# EAGLE design ecg_leaddetection_module_v2.0.1_jan2024 (EAGLE 9.6.2)
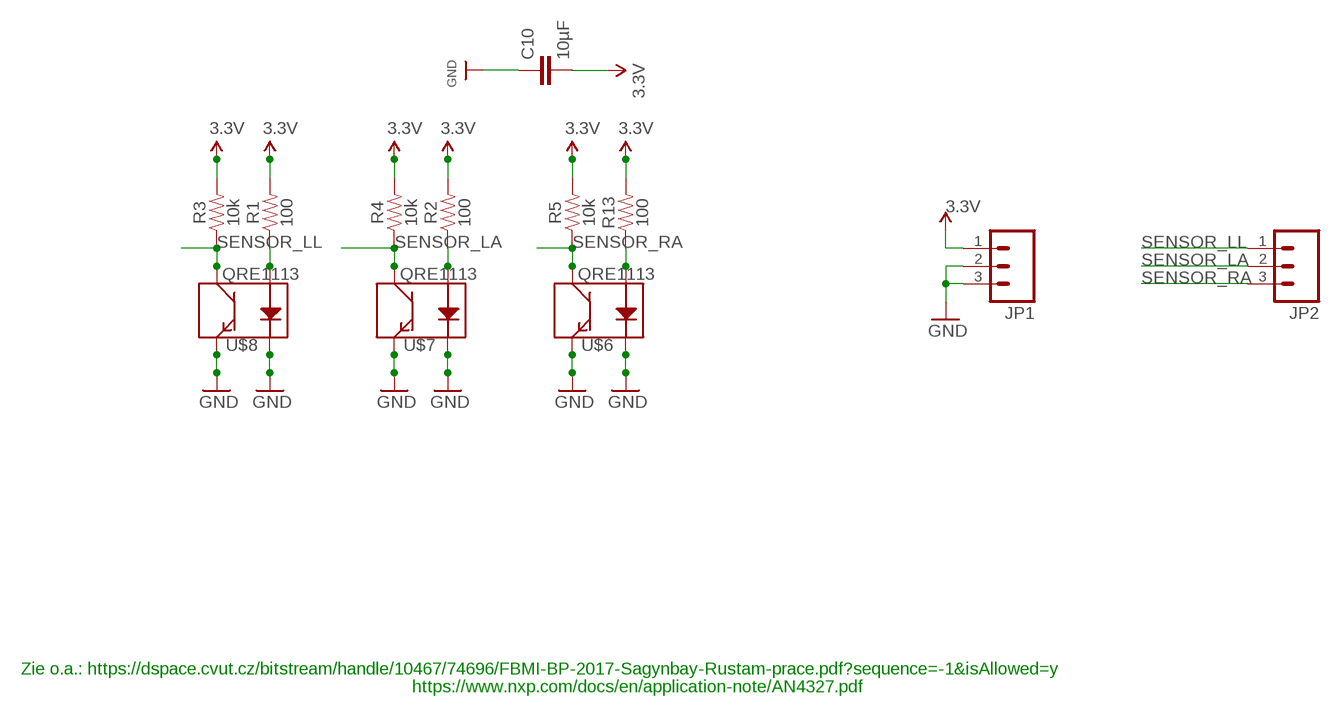
[diagram p0: schematic, sheet 1]

## Parts
C10  10µF  C-EUC0805  [C0805]
JP1  M03PTH  [1X03]
JP2  M03PTH  [1X03]
R1  100  100OHM-0603-1/4W-5%  [0603]
R2  100  100OHM-0603-1/4W-5%  [0603]
R3  10k  10KOHM-0603-1/10W-1%  [0603]
R4  10k  10KOHM-0603-1/10W-1%  [0603]
R5  10k  10KOHM-0603-1/10W-1%  [0603]
R13  100  100OHM-0603-1/4W-5%  [0603]
U$6  QRE1113  [QRE1113]
U$7  QRE1113  [QRE1113]
U$8  QRE1113  [QRE1113]

## Nets
3.3V: C10.2 JP1.1 R1.2 R2.2 R3.2 R4.2 R5.2 R13.2 ; supply symbol labelled VCC
GND: C10.1 JP1.2 JP1.3 U$6.2(K) U$6.4(E) U$7.2(K) U$7.4(E) U$8.2(K) U$8.4(E)
N$1: R1.1 U$8.1(A)
N$2: R2.1 U$7.1(A)
N$3: R13.1 U$6.1(A)
SENSOR_LA: JP2.2 R4.1 U$7.3(C)
SENSOR_LL: JP2.1 R3.1 U$8.3(C)
SENSOR_RA: JP2.3 R5.1 U$6.3(C)

## Notes on the sheet
- Zie o.a.: https://dspace.cvut.cz/bitstream/handle/10467/74696/FBMI-BP-2017-Sagynbay-Rustam-prace.pdf?sequence=-1&isAllowed=y
- https://www.nxp.com/docs/en/application-note/AN4327.pdf

## Library data of the parts
C10 = rcl:C-EU: CAPACITOR, European symbol; SPICEPREFIX: C
JP1 JP2 = SparkFun:M03: Header 3 Standard 3-pin 0.1" header. Use with straight break away headers (SKU : PRT-00116), right angle break away headers (PRT-00553), swiss pins (PRT-00743), machine pins (PRT-00117), and female headers (PRT-00115). Molex polarized connector foot print use with SKU : PRT-08232 with associated crimp pins and housings.
R1 R2 R13 = SparkFun-Resistors:100OHM: 100Ω resistor A resistor is a passive two-terminal electrical component that implements electrical resistance as a circuit element. Resistors act to reduce current flow, and, at the same time, act to lower voltage levels within circuits. - Wikipedia; PROD_ID: RES-12438
R3-R5 = SparkFun-Resistors:10KOHM: 10kΩ resistor A resistor is a passive two-terminal electrical component that implements electrical resistance as a circuit element. Resistors act to reduce current flow, and, at the same time, act to lower voltage levels within circuits. - Wikipedia; PROD_ID: RES-00824
U$6-U$8 = SparkFun:QRE1113

## Net classes
1 pwr: width 0.254 mm
2 ground: width 0.254 mm, drill 0.254 mm, clearance 0.152 mm
3 power: width 0.254 mm, drill 0.254 mm, clearance 0.152 mm

## Board
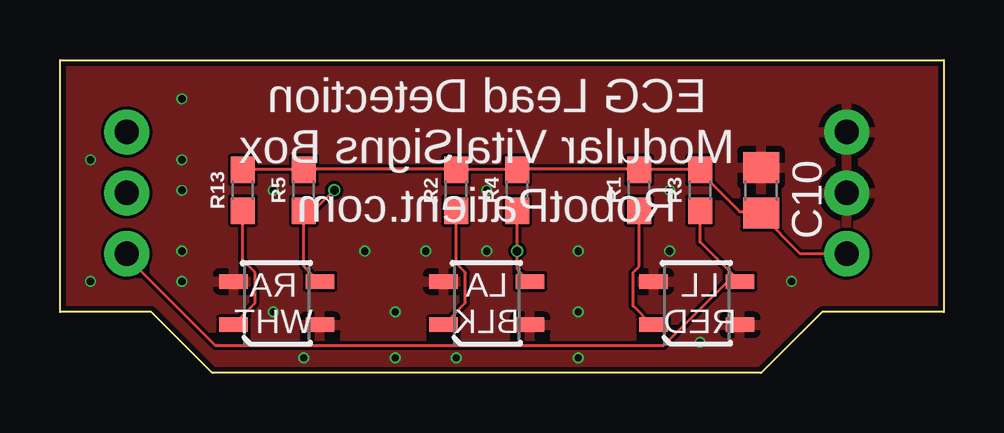
[diagram p1: board, top side]
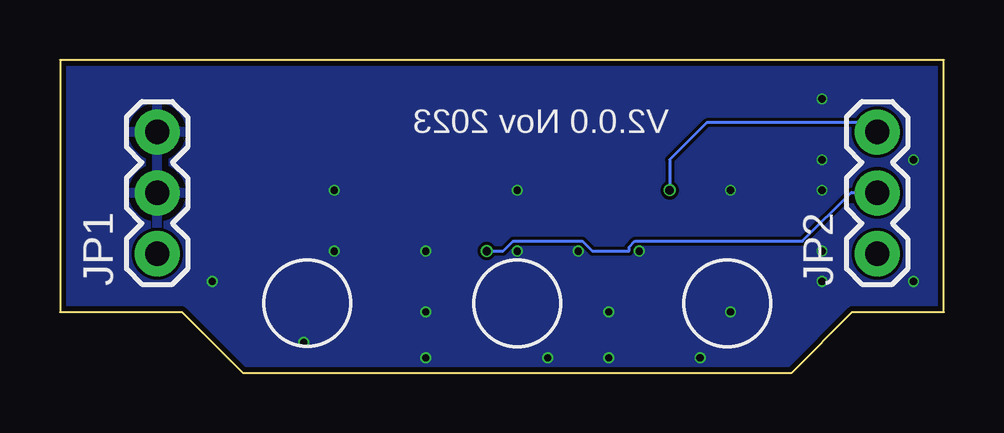
[diagram p2: board, bottom side, seen from below]

Size 36.83 x 13.06 mm. Coordinates in mm from the lower left corner, seen from the top.
Outline: 36.83,13.06 36.83,2.54 31.75,2.54 29.21,0 6.35,0 3.81,2.54 0,2.54 0,13.06 36.83,13.06
Copper layers (1*16): Top 0.035mm / dielectric 1.6mm / Bottom 0.035mm
Design rules "jlcpcb-2layers_2023": minimum track width 5mil, minimum drill 0.3mm, track to track 5mil, track to pad 5mil, pad to pad 5mil, via to via 5mil, smd to smd 5mil, copper to edge 0.2mm, drill to drill 6mil, minimum pad ring 10mil, minimum via ring 3mil, stop-mask expansion 4mil, vias tented up to drill 20mil, thermal gap 10mil

### Footprints (pad centres in the part's own frame; a part is rotated, then mirrored left to right if it is on the bottom)
C0805 = smd 1.3 x 1.5: 1 -0.95,0; 2 0.95,0
1X03 = drill 1.016 pad 1.88: 1 0,0; 2 2.54,0; 3 5.08,0
0603 = smd 1.1 x 1: 1 -0.85,0; 2 0.85,0
QRE1113 = smd 1.2 x 0.6: 1 -1.8,-0.9; 2 1.8,-0.9; 3 1.8,0.9; 4 -1.8,0.9

### Placement (x,y rotation side)
C10  29.21,7.62 270 top
JP1  32.78,4.97 90 bottom
JP2  2.78,4.97 90 bottom
R1  24.13,7.62 90 top
R2  16.51,7.62 90 top
R3  26.67,7.62 90 top
R4  19.05,7.62 90 top
R5  10.16,7.62 90 top
R13  7.62,7.62 90 top
U$6  9.03,2.91 0 top
U$7  17.78,2.91 0 top
U$8  26.53,2.91 0 top

### Tracks (layer width: path | path; a pad name or v marks a point on that pad's centre or on a via)
3.3V
  Top 0.127: 10.16,8.51 7.62,8.51 R13.2 | 16.51,8.51 19.05,8.51 | 24.13,8.51 26.67,8.51 R3.2 26.67,8.38 28.32,6.73 29.21,6.73 C10.2 29.21,6.6 30.85,4.97 JP1.1 | 24.13,8.51 19.05,8.51 | 19.05,8.51 R4.2 | 24.13,8.51 R1.2 | 16.51,8.51 10.16,8.51 | 10.16,8.51 R5.2 | 16.51,8.51 R2.2
GND  (via drill 0.3)
  other vias: 30.48,3.81 26.67,1.27 25.4,5.08 21.59,5.08 17.78,5.08 12.7,5.08 15.24,5.08 13.97,2.54 8.89,7.62 17.78,7.62 25.4,7.62 21.59,2.54 21.59,0.62 16.51,0.62 13.97,0.62 10.16,0.62 8.89,2.54 5.08,3.81 1.27,3.81 5.08,5.08 5.08,7.62 5.08,8.89 1.27,8.89 5.08,11.43
  pour Bottom: 44.17,49.89 44.17,-3.45 -10.44,-3.45 -10.44,49.89
  pour Top: 51.79,47.35 51.79,-5.99 -12.98,-5.99 -12.98,47.35
N$1
  Top 0.127: R1.1 24.13,4.45 23.88,4.19 23.88,2.79 24.64,2.03 U$8.1
N$2
  Top 0.127: R2.1 16.51,4.57 16.89,4.19 16.89,2.92 U$7.1
N$3
  Top 0.127: R13.1 7.62,4.7 8.13,4.19 8.13,2.92 7.24,2.03 U$6.1
SENSOR_LA  (via drill 0.35)
  Top 0.127: R4.1 v19.05,5.08 19.05,4.32 19.3,4.06 | 19.3,4.06 19.56,3.81 U$7.3 19.3,4.06
  Bottom 0.127: v19.05,5.08 18.37,5.08 17.95,5.5 15.07,5.5 14.65,5.08 13.12,5.08 13.12,5.25 12.87,5.5 5.89,5.5 3.86,7.53 2.8,7.53 JP2.2
SENSOR_LL
  Top 0.127: R3.1 26.67,5.46 28.07,4.06 | 28.07,4.06 U$8.3 28.07,4.06 | 28.07,4.06 25.15,1.14 6.48,1.14 2.79,4.83 2.79,4.96 JP2.1
SENSOR_RA  (via drill 0.35)
  Top 0.127: 10.16,6.35 10.16,4.45 10.79,3.81 U$6.3 | 10.16,6.35 R5.1 | v11.43,7.62 10.16,6.35
  Bottom 0.127: v11.43,7.62 11.43,8.89 9.88,10.44 3.17,10.44 JP2.3

### Text on the board
tSilk: RA / WHT | LA / BLK | LL / RED
_tsilk: ECG Lead Detection / Modular VitalSigns Box | RobotPatient.com